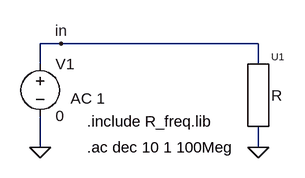
[diagram p0: schematic R_freq.asc]
R_freq.asc, the LTspice schematic file:
Version 4
SHEET 1 1364 680
WIRE -272 -272 -304 -272
WIRE 32 -272 -272 -272
WIRE -304 -240 -304 -272
WIRE 32 -240 32 -272
WIRE -304 -112 -304 -160
WIRE 32 -112 32 -144
FLAG 32 -112 0
FLAG -304 -112 0
FLAG -272 -272 in
SYMBOL voltage -304 -256 R0
WINDOW 123 47 69 Left 0
WINDOW 39 0 0 Left 0
SYMATTR Value2 AC 1
SYMATTR InstName V1
SYMATTR Value 0
SYMBOL r_freq 32 -192 R0
SYMATTR InstName U1
TEXT -232 -112 Left 0 !.ac dec 10 1 100Meg
TEXT -232 -152 Left 0 !.include R_freq.lib

The netlist it stands for:
* R_freq.asc
V1 in 0 0 AC 1
XU1 in 0 R  ; pins P1 P2
.ac dec 10 1 100Meg
.include R_freq.lib
.backanno
.end